# EAGLE design battery (EAGLE 9.4.2)
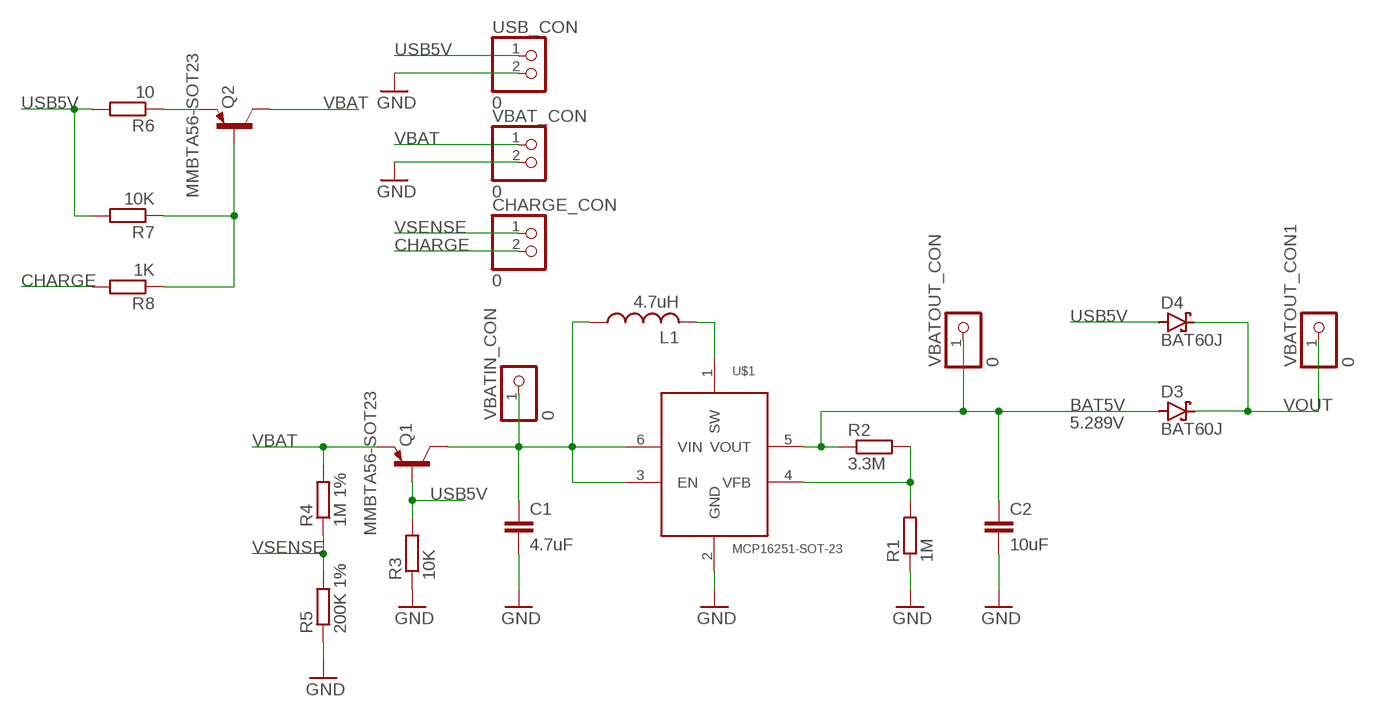
[diagram p0: schematic, sheet 1]

## Parts
C1  4.7uF  C-EUC0805  [C0805]
C2  10uF  C-EUC0805  [C0805]
CHARGE_CON  0  PINHD-1X2  [1X02]
D3  BAT60J  [SOD323_ST]
D4  BAT60J  [SOD323_ST]
L1  4.7uH  L-USL4532P  [L4532P]
Q1  MMBTA56-SOT23  [SOT23]
Q2  MMBTA56-SOT23  [SOT23]
R1  1M  R-EU_R0805  [R0805]
R2  3.3M  R-EU_R0805  [R0805]
R3  10K  R-EU_R0805  [R0805]
R4  1M 1%  R-EU_R0805  [R0805]
R5  200K 1%  R-EU_R0805  [R0805]
R6  10  R-EU_R0805  [R0805]
R7  10K  R-EU_R0805  [R0805]
R8  1K  R-EU_R0805  [R0805]
U$1  MCP16251-SOT-23  [SOT-23]
USB_CON  0  PINHD-1X2  [1X02]
VBAT_CON  0  PINHD-1X2  [1X02]
VBATIN_CON  0  PINHD-1X1  [1X01]
VBATOUT_CON  0  PINHD-1X1  [1X01]
VBATOUT_CON1  0  PINHD-1X1  [1X01]

## Nets
BAT5V: C2.1 D3.A R2.1 U$1.5(VOUT) VBATOUT_CON.1
CHARGE: CHARGE_CON.2 R8.2
GND: C1.2 C2.2 R1.1 R3.1 R5.1 U$1.2(GND) USB_CON.2 VBAT_CON.2
N$1: L1.2 U$1.1(SW)
N$2: R1.2 R2.2 U$1.4(VFB)
N$3: Q2.1(B) R7.1 R8.1
N$5: Q2.2(E) R6.1
N$10: C1.1 L1.1 Q1.3(C) U$1.3(EN) U$1.6(VIN) VBATIN_CON.1
USB5V: D4.A Q1.1(B) R3.2 R6.2 R7.2 USB_CON.1
VBAT: Q1.2(E) Q2.3(C) R4.2 VBAT_CON.1
VOUT: D3.C D4.C VBATOUT_CON1.1
VSENSE: CHARGE_CON.1 R4.1 R5.2

## Notes on the sheet
- 5.289V

## Library data of the parts
C1 C2 = rcl:C-EU: CAPACITOR, European symbol; SPICEPREFIX: C
CHARGE_CON USB_CON VBAT_CON = pinhead:PINHD-1X2: PIN HEADER
D3 D4 = diode:BAT60J: Schottky barrier diode Source: www.st.com, BAT60J.pdf
L1 = rcl:L-US: INDUCTOR, American symbol; SPICEPREFIX: L
Q1 Q2 = transistor-pnp:*-?: PNP Transistor
R1-R8 = rcl:R-EU_: RESISTOR, European symbol; SPICEPREFIX: R
U$1 = battery:MCP16251-SOT-23
VBATIN_CON VBATOUT_CON VBATOUT_CON1 = pinhead:PINHD-1X1: PIN HEADER

## Board
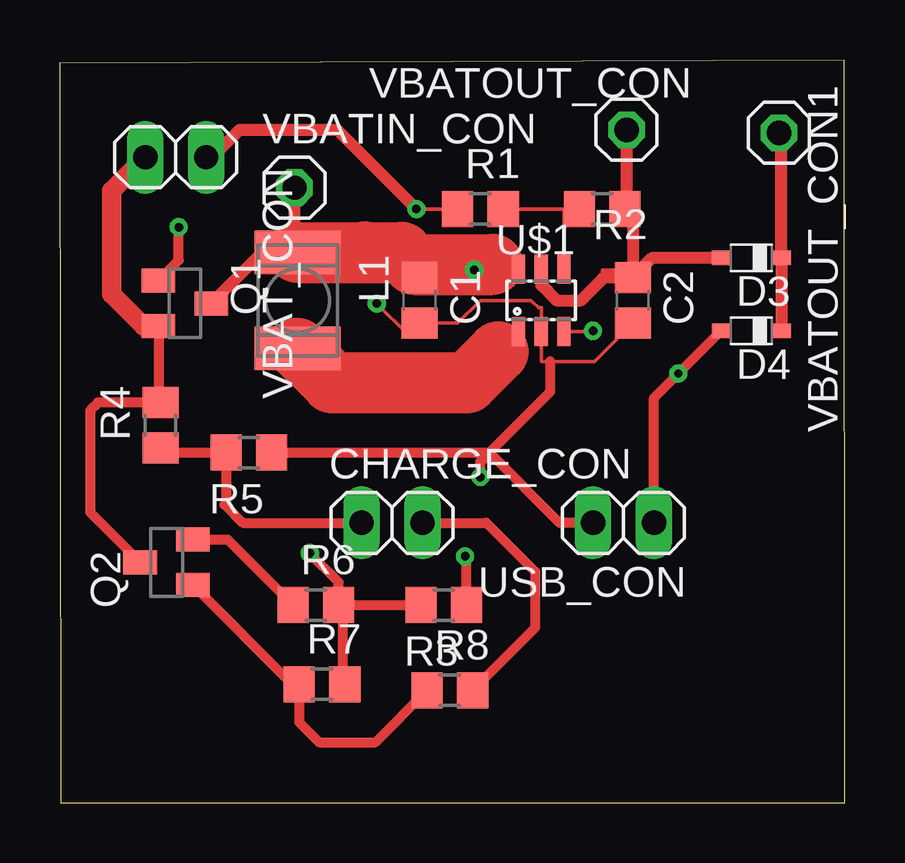
[diagram p1: board, top side]
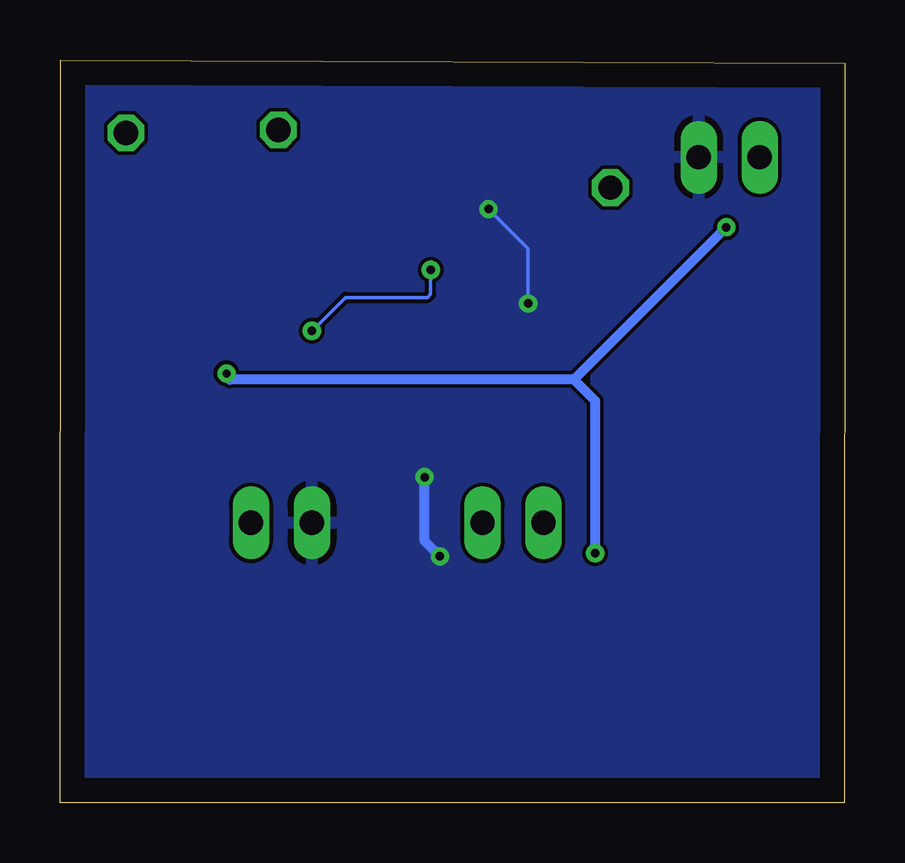
[diagram p2: board, bottom side, seen from below]

Size 32.73 x 30.98 mm. Coordinates in mm from the lower left corner, seen from the top.
Outline: 0.04,0 32.73,0 32.69,30.98 0,30.85 0.04,0
Copper layers (1*16): Top 0.035mm / dielectric 1.5mm / Bottom 0.035mm
Design rules "default": minimum track width 6mil, minimum drill 0.35mm, track to track 6mil, track to pad 6mil, pad to pad 6mil, via to via 6mil, smd to smd 6mil, copper to edge 40mil, drill to drill 6mil, minimum pad ring 10mil, minimum via ring 8mil, stop-mask expansion 4mil, vias tented up to drill 0mil, thermal gap 10mil

### Footprints (pad centres in the part's own frame; a part is rotated, then mirrored left to right if it is on the bottom)
C0805 = smd 1.3 x 1.5: 1 -0.95,0; 2 0.95,0
1X02 = drill 1.016 long: 1 -1.27,0; 2 1.27,0
SOD323_ST = smd 0.8 x 0.6: A 1.25,0; C -1.25,0
L4532P = smd 1.8 x 3.6: 1 -2,0; 2 2,0
SOT23 = smd 1 x 1.4: 1 -0.95,-1.1; 2 0.95,-1.1; 3 0,1.1
R0805 = smd 1.3 x 1.5: 1 -0.95,0; 2 0.95,0
SOT-23 = smd 0.55 x 1.2: 1 -0.95,-1.3; 2 0,-1.3; 3 0.95,-1.3; 4 0.95,1.3; 5 0,1.3; 6 -0.95,1.3
1X01 = drill 1.016 octagon: 1 0,0

### Placement (x,y rotation side)
C1  14.99,20.95 270 top
C2  23.88,20.95 270 top
CHARGE_CON  13.84,11.68 0 top
D3  28.83,22.73 180 top
D4  28.83,19.69 180 top
L1  9.91,20.95 270 top
Q1  5.21,20.83 270 top
Q2  4.45,10.03 90 top
R1  17.53,24.77 0 top
R2  22.61,24.77 180 top
R3  16,8.26 180 top
R4  4.19,15.75 90 top
R5  7.87,14.61 180 top
R6  10.67,8.26 0 top
R7  10.92,4.95 0 top
R8  16.26,4.7 0 top
U$1  20.07,20.95 0 top
USB_CON  23.5,11.68 180 top
VBAT_CON  4.83,26.92 0 top
VBATIN_CON  9.78,25.65 0 top
VBATOUT_CON  23.62,28.07 0 top
VBATOUT_CON1  29.97,27.94 0 top

### Tracks (layer width: path | path; a pad name or v marks a point on that pad's centre or on a via)
BAT5V
  Top 0.152: 23.88,24.45 23.88,22.23 | 23.88,22.23 C2.1 | 22.61,21.84 22.61,22.23 23.88,22.23
  Top 0.508: C2.1 22.67,21.91 22.61,21.84 21.72,20.95 20.7,20.95 20.07,21.59 U$1.5 | C2.1 23.88,24.45 R2.1 23.62,24.83 VBATOUT_CON.1 | C2.1 24.7,22.73 D3.A
CHARGE
  Top 0.406: CHARGE_CON.2 17.78,11.68 19.81,9.65 19.81,7.3 R8.2
GND  (via drill 0.35)
  Top 0.152: C2.2 22.29,18.41 20.45,18.41 20.07,18.41 U$1.2 20.07,20.65 19.94,20.65 19.64,20.95 17.53,20.95 16.58,20.01 C1.2 14.51,19.53 v13.21,20.83 | R1.1 v14.86,24.77
  Top 0.406: R5.1 17.91,14.61 | 17.91,14.61 20.45,17.15 20.45,18.41 | USB_CON.2 20.83,11.68 17.91,14.61 | R3.1 16.95,10.23 v16.89,10.29 | v17.53,13.59 17.53,14.22 17.91,14.61
  Top 0.508: VBAT_CON.2 6.22,26.79 7.49,28.07 11.56,28.07 v14.86,24.77
  Bottom 0.152: v14.86,24.77 13.21,23.11 v13.21,20.83
  Bottom 0.406: v16.89,10.29 17.53,10.92 v17.53,13.59
  pour Bottom: 0.51,30.48 0.51,0.38 32.26,0.38 32.26,30.23 32,30.48 0.64,30.48
N$1
  Top 0.152: 18.27,18.81 U$1.1
  Top 2.54: L1.2 11.33,17.53 16.99,17.53 18.27,18.81
N$2
  Top 0.152: R2.2 R1.2 21.02,24.77 U$1.4
N$3
  Top 0.406: Q2.1 9.68,4.95 R7.1 9.97,3.36 10.79,2.54 13.15,2.54 R8.1
N$5
  Top 0.406: Q2.2 6.99,10.98 R6.1
N$10  (via drill 0.35)
  Top 0.152: U$1.3 22.2,19.66 v22.23,19.69 | U$1.6 17.3,22.25 v17.27,22.23 15.31,22.23 C1.1 13.78,21.91 12.7,22.99
  Top 0.508: VBATIN_CON.1 9.78,23.08 L1.1 8.43,22.95 Q1.3
  Top 2.54: L1.1 12.67,22.95 | 12.67,22.95 12.7,22.99 | 12.67,22.95 14.26,22.95 14.76,22.45 18.03,22.45
  Bottom 0.152: v22.23,19.69 20.83,21.08 17.4,21.08 17.27,21.21 v17.27,22.23
USB5V  (via drill 0.35)
  Top 0.406: Q1.1 4.95,22.62 v4.95,24 | D4.A 27.56,19.69 v25.78,17.91 24.77,16.89 USB_CON.1 | 11.81,8.26 R6.2 11.62,9.21 v10.41,10.41 | 11.81,8.26 R3.2 | R7.2 11.81,5.01 11.81,8.26
  Bottom 0.406: v4.95,24 11.3,17.65 | 11.3,17.65 25.65,17.65 25.78,17.78 v25.78,17.91 | v10.41,10.41 10.41,16.76 11.3,17.65
VBAT
  Top 0.406: Q1.2 4.11,16.78 R4.2 1.58,16.7 1.27,16.38 1.27,12.11 Q2.3
  Top 0.813: 2.96,26.13 2.96,26.33 VBAT_CON.1 2.16,25.53 2.16,21.21 3.49,19.88 Q1.2
VOUT
  Top 0.508: D4.C D3.C 30.08,27.83 VBATOUT_CON1.1
VSENSE
  Top 0.406: R4.1 4.38,14.61 R5.2 6.92,12.51 6.86,12.45 7.62,11.68 CHARGE_CON.1